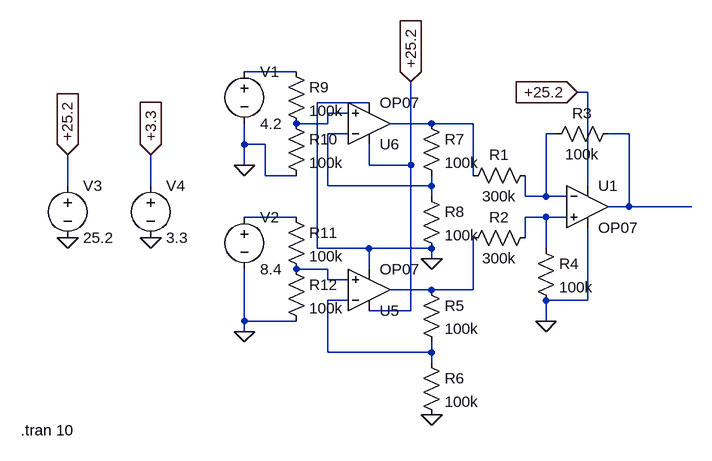
[diagram p0: schematic LipoChecker.asc]
LipoChecker.asc, the LTspice schematic file:
Version 4
SHEET 1 880 680
WIRE -576 -160 -656 -160
WIRE -128 -128 -144 -128
WIRE -464 -112 -544 -112
WIRE -496 -96 -528 -96
WIRE -528 -80 -528 -96
WIRE -528 -80 -576 -80
WIRE -368 -80 -432 -80
WIRE -304 -80 -368 -80
WIRE -496 -64 -528 -64
WIRE -176 -64 -192 -64
WIRE -64 -64 -96 -64
WIRE -656 -48 -656 -80
WIRE -624 -48 -656 -48
WIRE -656 -16 -656 -48
WIRE -464 -16 -464 -48
WIRE -400 -16 -400 -144
WIRE -400 -16 -464 -16
WIRE -624 0 -624 -48
WIRE -576 0 -624 0
WIRE -304 0 -304 -80
WIRE -928 16 -928 -32
WIRE -800 16 -800 -32
WIRE -528 16 -528 -64
WIRE -368 16 -368 0
WIRE -368 16 -528 16
WIRE -128 16 -128 -128
WIRE -368 32 -368 16
WIRE -224 32 -224 0
WIRE -192 32 -192 -64
WIRE -192 32 -224 32
WIRE -160 32 -192 32
WIRE -64 48 -64 -64
WIRE -64 48 -96 48
WIRE 32 48 -64 48
WIRE -576 64 -656 64
WIRE -192 64 -224 64
WIRE -160 64 -192 64
WIRE -224 96 -224 64
WIRE -544 112 -544 -112
WIRE -464 112 -544 112
WIRE -368 112 -464 112
WIRE -192 112 -192 64
WIRE -368 128 -368 112
WIRE -528 144 -576 144
WIRE -464 144 -464 112
WIRE -528 160 -528 144
WIRE -496 160 -528 160
WIRE -368 176 -432 176
WIRE -304 176 -304 96
WIRE -304 176 -368 176
WIRE -496 192 -528 192
WIRE -128 192 -128 80
WIRE -128 192 -192 192
WIRE -400 208 -400 -16
WIRE -400 208 -464 208
WIRE -656 224 -656 144
WIRE -576 224 -656 224
WIRE -192 224 -192 192
WIRE -656 240 -656 224
WIRE -528 272 -528 192
WIRE -368 272 -368 256
WIRE -368 272 -528 272
WIRE -368 288 -368 272
FLAG -368 128 0
FLAG -192 224 0
FLAG -368 368 0
FLAG -656 -16 0
FLAG -656 240 0
FLAG -928 -32 +25.2
IOPIN -928 -32 In
FLAG -928 96 0
FLAG -800 96 0
FLAG -800 -32 +3.3
IOPIN -800 -32 In
FLAG -400 -144 +25.2
IOPIN -400 -144 In
FLAG -144 -128 +25.2
IOPIN -144 -128 In
SYMBOL Opamps\\OP07 -128 -16 R0
SYMATTR InstName U1
SYMBOL res -208 -16 R90
WINDOW 0 0 56 VBottom 2
WINDOW 3 32 56 VTop 2
SYMATTR InstName R1
SYMATTR Value 300k
SYMATTR SpiceLine tol=1 pwr=1/4
SYMBOL res -208 80 R90
WINDOW 0 0 56 VBottom 2
WINDOW 3 32 56 VTop 2
SYMATTR InstName R2
SYMATTR Value 300k
SYMATTR SpiceLine tol=1 pwr=1/4
SYMBOL res -80 -80 R90
WINDOW 0 0 56 VBottom 2
WINDOW 3 32 56 VTop 2
SYMATTR InstName R3
SYMATTR Value 100k
SYMATTR SpiceLine tol=1 pwr=1/4
SYMBOL res -208 96 R0
SYMATTR InstName R4
SYMATTR Value 100k
SYMATTR SpiceLine tol=1 pwr=1/4
SYMBOL res -384 160 R0
SYMATTR InstName R5
SYMATTR Value 100k
SYMATTR SpiceLine tol=1 pwr=1/4
SYMBOL res -384 272 R0
SYMATTR InstName R6
SYMATTR Value 100k
SYMATTR SpiceLine tol=1 pwr=1/4
SYMBOL res -384 -96 R0
SYMATTR InstName R7
SYMATTR Value 100k
SYMATTR SpiceLine tol=1 pwr=1/4
SYMBOL res -384 16 R0
SYMATTR InstName R8
SYMATTR Value 100k
SYMATTR SpiceLine tol=1 pwr=1/4
SYMBOL Opamps\\OP07 -464 240 M180
SYMATTR InstName U5
SYMBOL Opamps\\OP07 -464 -16 M180
SYMATTR InstName U6
SYMBOL voltage -656 -176 R0
WINDOW 123 0 0 Left 0
WINDOW 39 0 0 Left 0
SYMATTR InstName V1
SYMATTR Value 4.2
SYMBOL voltage -656 48 R0
WINDOW 123 0 0 Left 0
WINDOW 39 0 0 Left 0
SYMATTR InstName V2
SYMATTR Value 8.4
SYMBOL voltage -928 0 R0
WINDOW 123 0 0 Left 0
WINDOW 39 0 0 Left 0
SYMATTR InstName V3
SYMATTR Value 25.2
SYMBOL voltage -800 0 R0
WINDOW 123 0 0 Left 0
WINDOW 39 0 0 Left 0
SYMATTR InstName V4
SYMATTR Value 3.3
SYMBOL res -592 -96 R0
SYMATTR InstName R10
SYMATTR Value 100k
SYMATTR SpiceLine tol=1 pwr=1/4
SYMBOL res -592 -176 R0
SYMATTR InstName R9
SYMATTR Value 100k
SYMATTR SpiceLine tol=1 pwr=1/4
SYMBOL res -592 48 R0
SYMATTR InstName R11
SYMATTR Value 100k
SYMATTR SpiceLine tol=1 pwr=1/4
SYMBOL res -592 128 R0
SYMATTR InstName R12
SYMATTR Value 100k
SYMATTR SpiceLine tol=1 pwr=1/4
TEXT -1000 392 Left 2 !.tran 10

The netlist it stands for:
* LipoChecker.asc
XU1 N008 N005 +25.2 0 N006 LT1001  ; OP07, pins In+ In- V+ V- OUT
R1 N005 N003 300k tol=1 pwr=1/4
R2 N008 N010 300k tol=1 pwr=1/4
R3 N006 N005 100k tol=1 pwr=1/4
R4 N008 0 100k tol=1 pwr=1/4
R5 N010 N011 100k tol=1 pwr=1/4
R6 N011 0 100k tol=1 pwr=1/4
R7 N003 N004 100k tol=1 pwr=1/4
R8 N004 0 100k tol=1 pwr=1/4
XU5 N009 N011 +25.2 0 N010 LT1001  ; OP07, pins In+ In- V+ V- OUT
XU6 N002 N004 +25.2 0 N003 LT1001  ; OP07, pins In+ In- V+ V- OUT
V1 N001 0 4.2
V2 N007 0 8.4
V3 +25.2 0 25.2
V4 +3.3 0 3.3
R10 N002 0 100k tol=1 pwr=1/4
R9 N001 N002 100k tol=1 pwr=1/4
R11 N007 N009 100k tol=1 pwr=1/4
R12 N009 0 100k tol=1 pwr=1/4
.tran 10
.lib LTC.lib
.backanno
.end